# Altium schematic sheet HYDRA_V2.1_POWER.SchDoc
size B; SheetNumber: 1; SheetTotal: 6
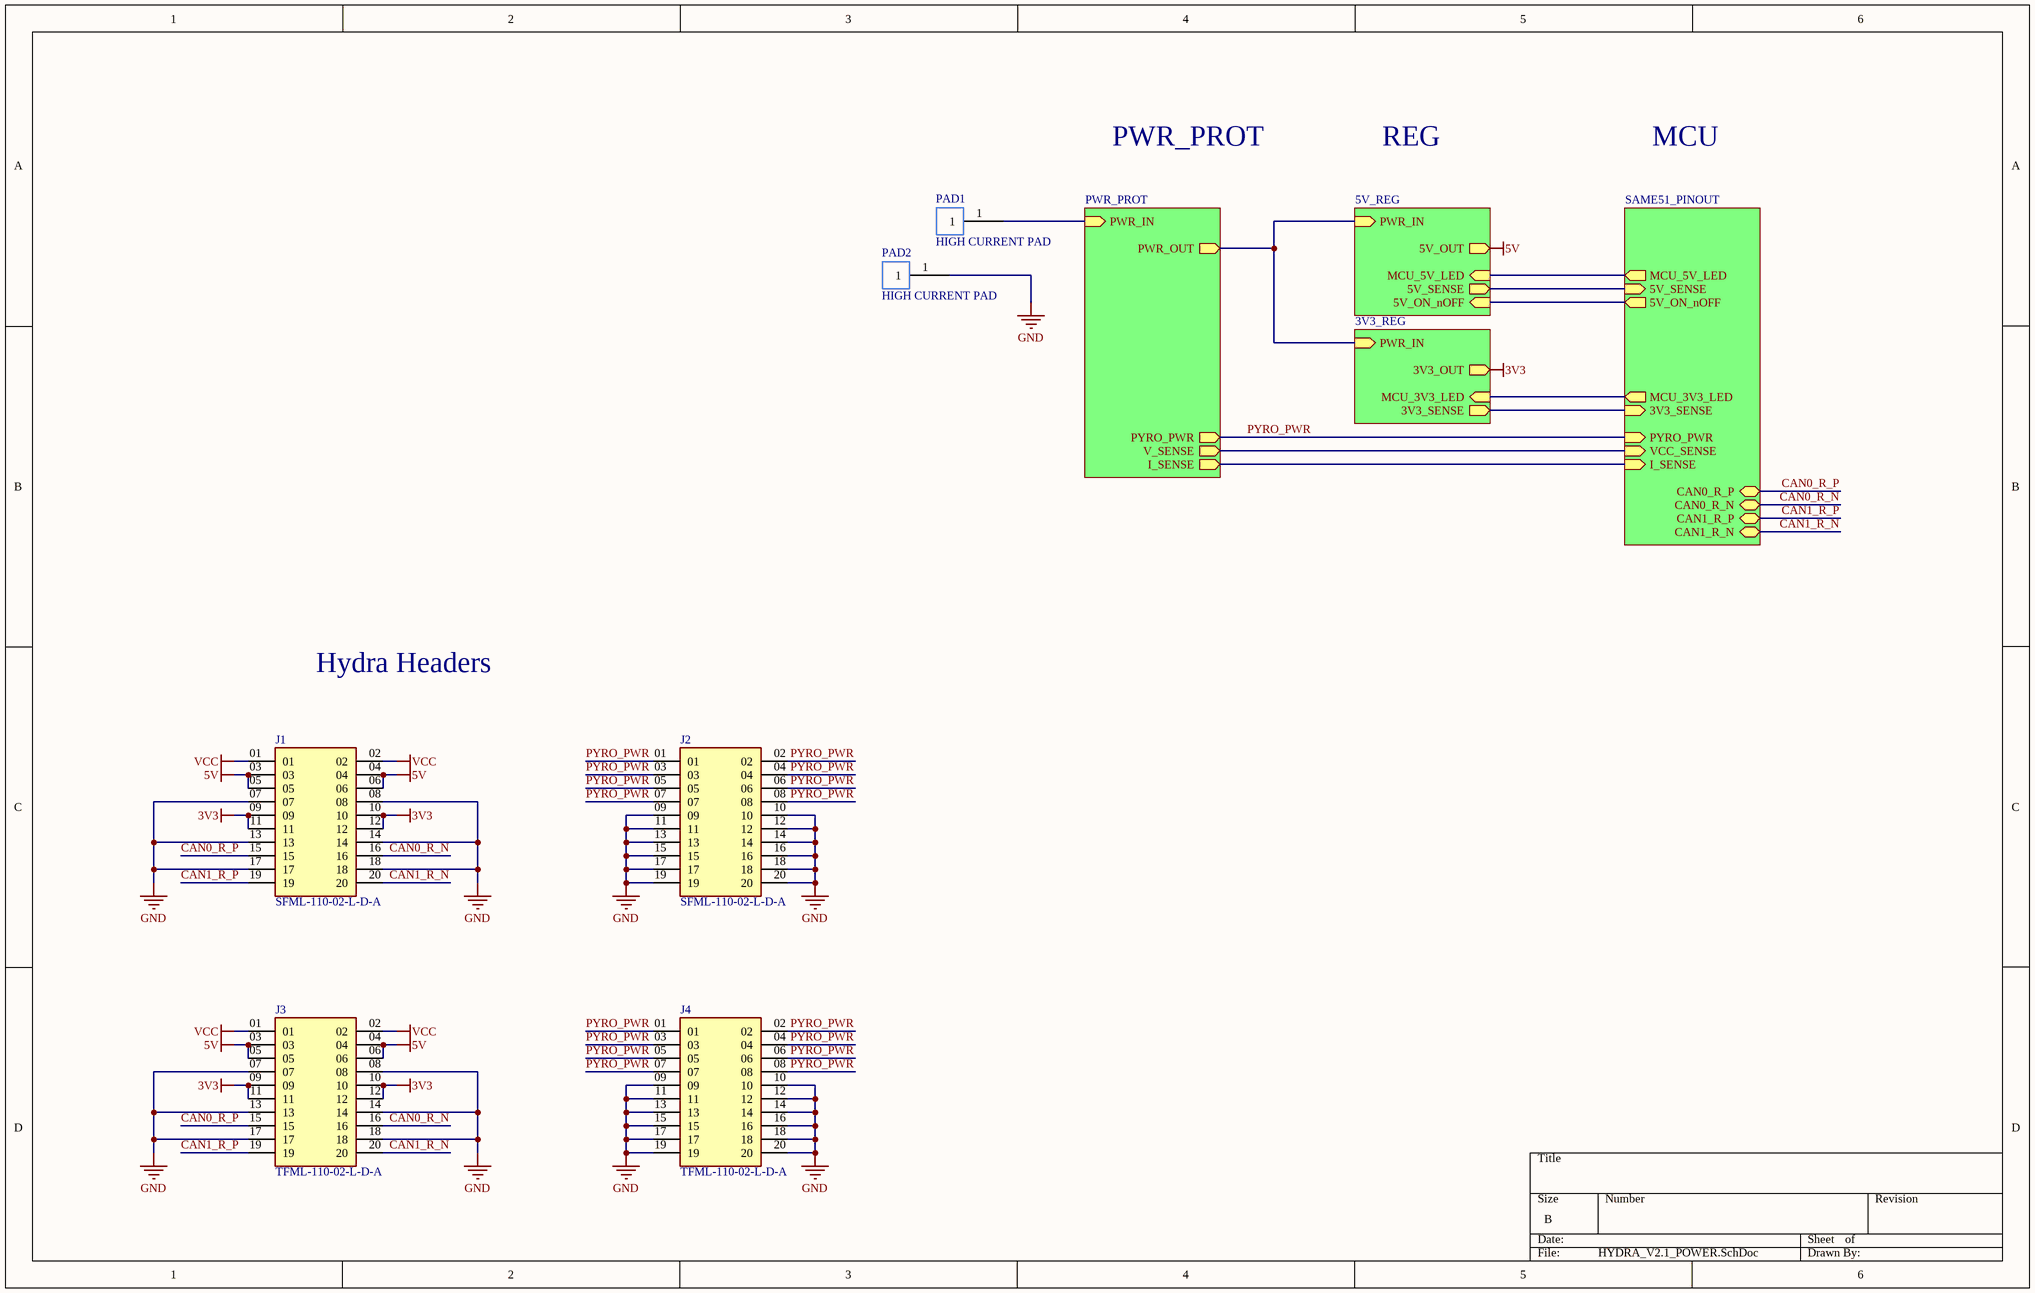
[diagram p0: HYDRA_V2.1_POWER.SchDoc]

## Parts
J1  SFML-110-02-L-D-A  [SFML-110-02-L-D-A-Footprint-1]
J2  SFML-110-02-L-D-A  [SFML-110-02-L-D-A-Footprint-1]
J3  TFML-110-02-L-D-A  [TFML-110-02-L-D-A-Footprint-1]
J4  TFML-110-02-L-D-A  [TFML-110-02-L-D-A-Footprint-1]
PAD1  HIGH CURRENT PAD  [HIGH CURRENT PAD-Footprint-1]
PAD2  HIGH CURRENT PAD  [HIGH CURRENT PAD-Footprint-1]

## Sub-sheets
3V3_REG = 3V3_REG: PWR_IN (in), 3V3_OUT (out), MCU_3V3_LED (in), 3V3_SENSE (out)
5V_REG = 5V_REG: PWR_IN (in), 5V_OUT (out), MCU_5V_LED (in), 5V_SENSE (out), 5V_ON_nOFF (in)
MCU_PINOUT = SAME51_PINOUT: CAN0_R_P (bidir), CAN0_R_N (bidir), PYRO_PWR (in), CAN1_R_P (bidir), CAN1_R_N (bidir), VCC_SENSE (in), I_SENSE (in), 5V_SENSE (in), MCU_5V_LED (out), 3V3_SENSE (in), MCU_3V3_LED (out), 5V_ON_nOFF (out)
PWR_PROT = PWR_PROT: PWR_IN (in), PWR_OUT (out), V_SENSE (out), I_SENSE (out), PYRO_PWR (out)

## Nets
3V3: J1.09 J1.10 J1.11 J1.12 J3.09 J3.10 J3.11 J3.12 ; sheet 3V3_REG/3V3_OUT
5V: J1.03 J1.04 J1.05 J1.06 J3.03 J3.04 J3.05 J3.06 ; sheet 5V_REG/5V_OUT
GND: J1.07 J1.08 J1.13 J1.14 J1.17 J1.18 J2.09 J2.10 J2.11 J2.12 J2.13 J2.14 J2.15 J2.16 J2.17 J2.18 J2.19 J2.20 J3.07 J3.08 J3.13 J3.14 J3.17 J3.18 J4.09 J4.10 J4.11 J4.12 J4.13 J4.14 J4.15 J4.16 J4.17 J4.18 J4.19 J4.20 PAD2.1
VCC: J1.01 J1.02 J3.01 J3.02
CAN0_R_N: J1.16 J3.16 ; sheet MCU_PINOUT/CAN0_R_N
CAN0_R_P: J1.15 J3.15 ; sheet MCU_PINOUT/CAN0_R_P
CAN1_R_N: J1.20 J3.20 ; sheet MCU_PINOUT/CAN1_R_N
CAN1_R_P: J1.19 J3.19 ; sheet MCU_PINOUT/CAN1_R_P
PYRO_PWR: J2.01 J2.02 J2.03 J2.04 J2.05 J2.06 J2.07 J2.08 J4.01 J4.02 J4.03 J4.04 J4.05 J4.06 J4.07 J4.08 ; sheet MCU_PINOUT/PYRO_PWR, sheet PWR_PROT/PYRO_PWR
NetPAD1_1: PAD1.1 ; sheet PWR_PROT/PWR_IN
(unnamed): sheet MCU_PINOUT/VCC_SENSE, sheet PWR_PROT/V_SENSE
(unnamed): sheet MCU_PINOUT/I_SENSE, sheet PWR_PROT/I_SENSE
(unnamed): sheet MCU_PINOUT/5V_SENSE, sheet 5V_REG/5V_SENSE
(unnamed): sheet MCU_PINOUT/MCU_5V_LED, sheet 5V_REG/MCU_5V_LED
(unnamed): sheet MCU_PINOUT/3V3_SENSE, sheet 3V3_REG/3V3_SENSE
(unnamed): sheet MCU_PINOUT/MCU_3V3_LED, sheet 3V3_REG/MCU_3V3_LED
(unnamed): sheet MCU_PINOUT/5V_ON_nOFF, sheet 5V_REG/5V_ON_nOFF
(unnamed): sheet 5V_REG/PWR_IN, sheet 3V3_REG/PWR_IN, sheet PWR_PROT/PWR_OUT

## Notes on the sheet
- PWR_PROT
- REG
- MCU
- Hydra Headers

## Library data of the parts
J1 J2 = CMP-002-00076-2: Headers & Wire Housings .050 Tiger Eye High-Reliability Locking Socket Strip
J3 J4 = CMP-002-00077-1: Conn Shrouded Header (4 Sides) HDR 20 POS 1.27mm Solder ST Top Entry SMD TIGER EYE™ Tube
PAD1 PAD2 = CMP-002-00087-2: Via stitched high current pad